# Altium schematic sheet MCU.SchDoc
size A3; SheetNumber: 1; SheetTotal: 5
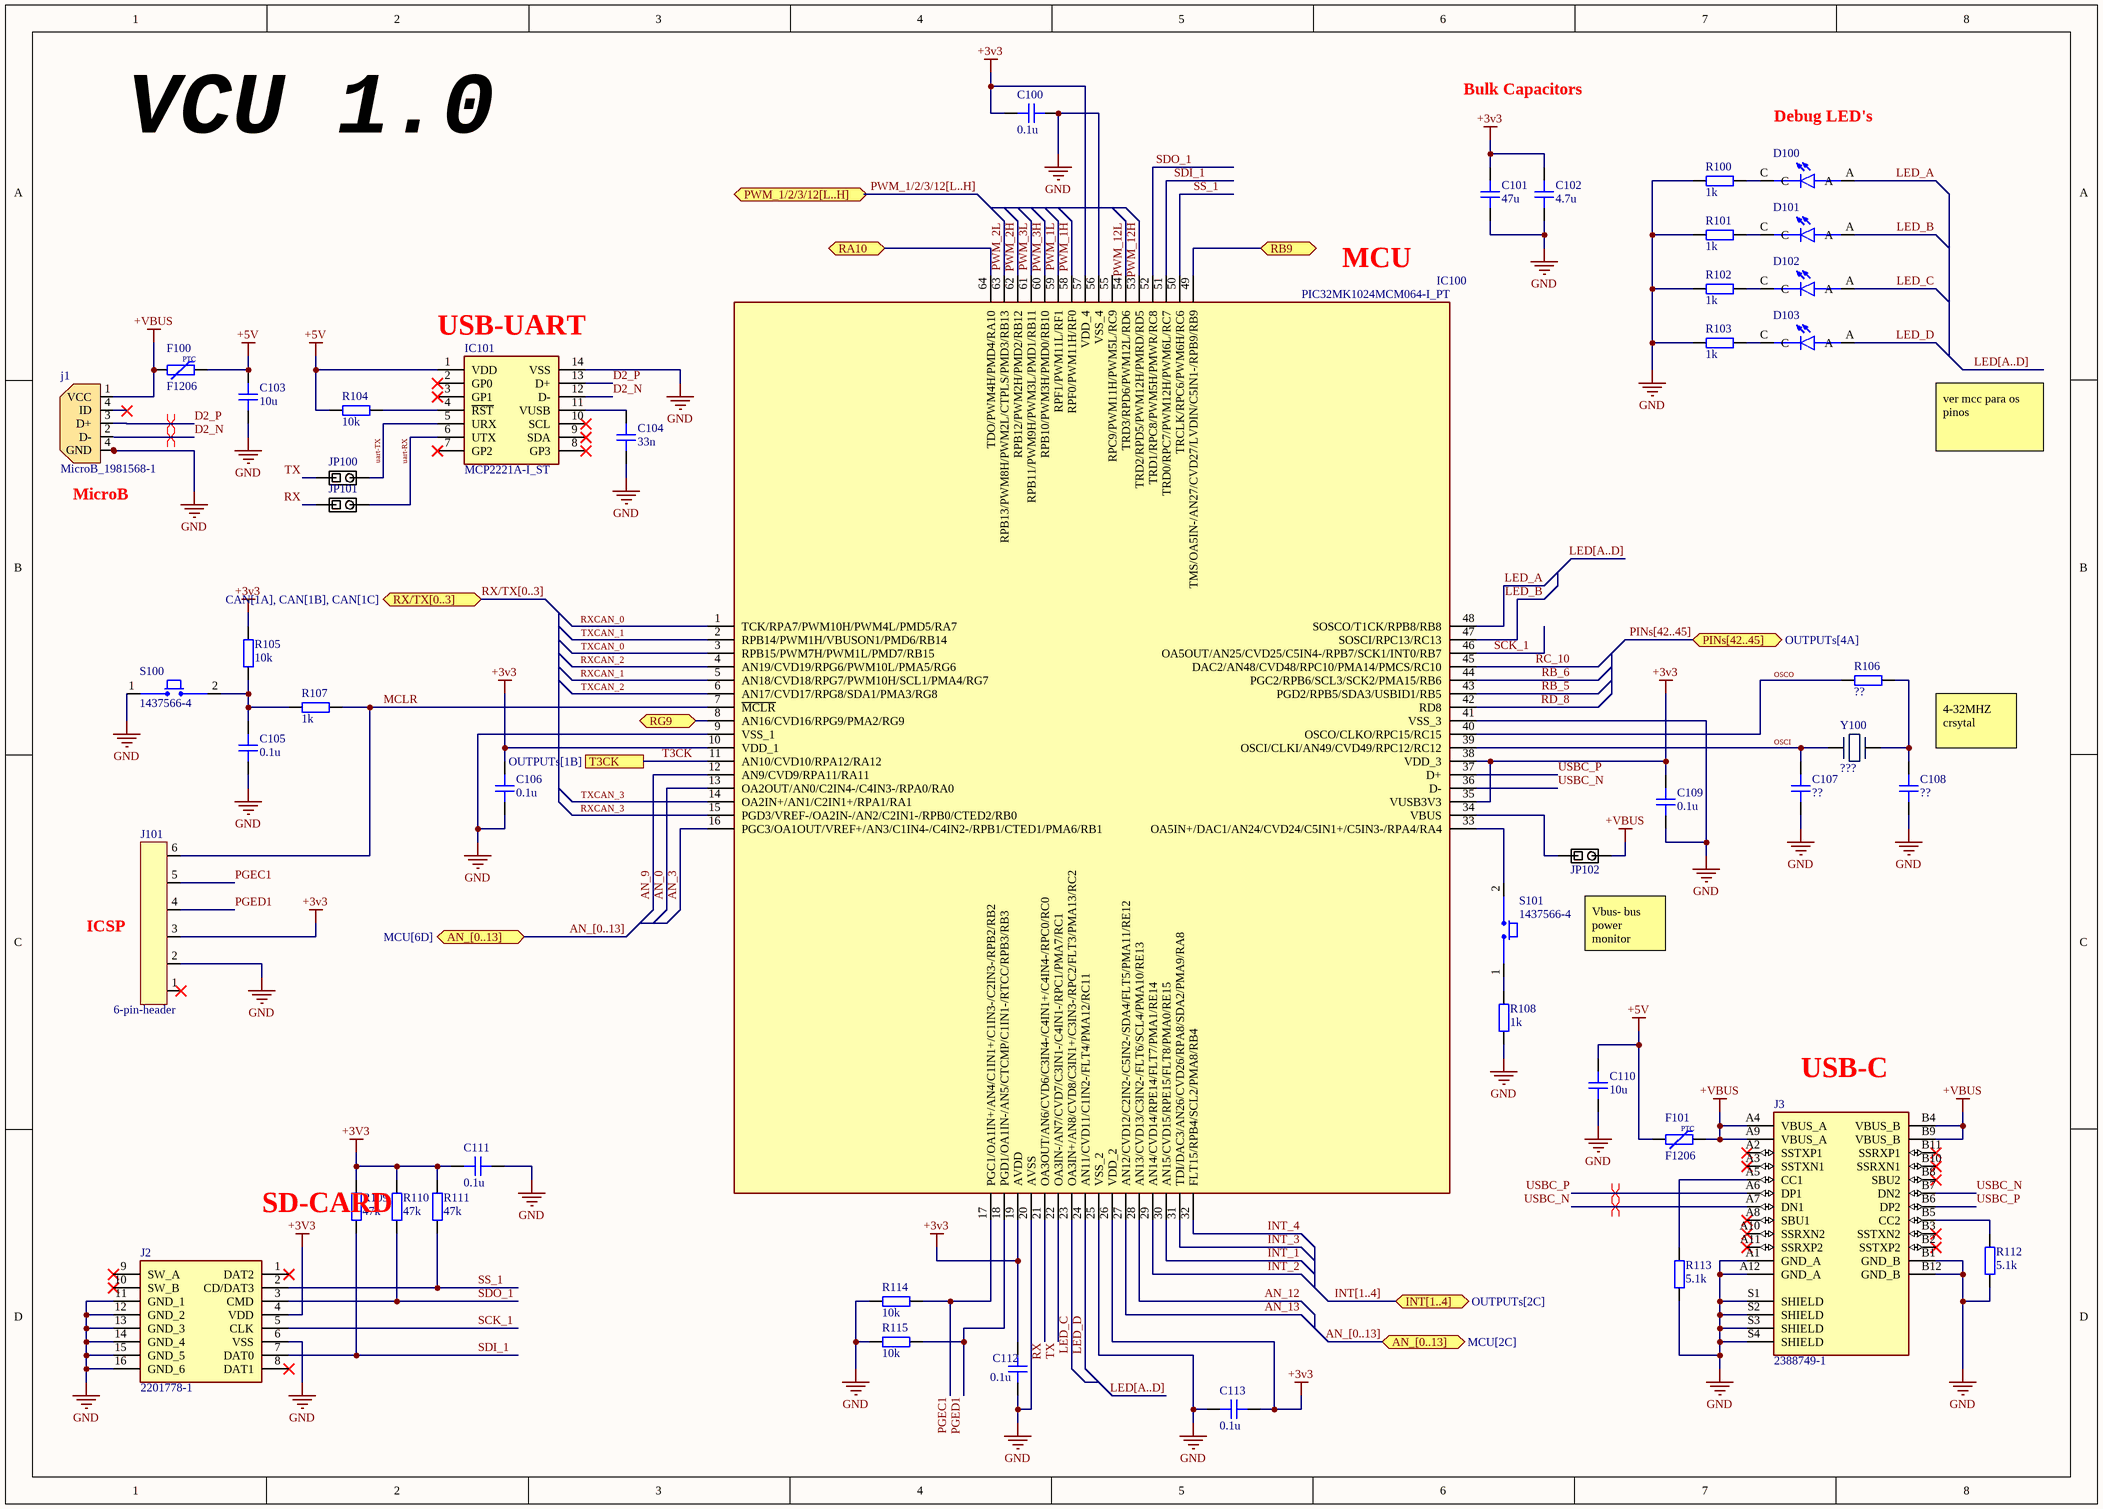
[diagram p0: MCU.SchDoc]

## Parts
C100  0.1u  [CAP_0805]
C101  47u  [CAP_0805]
C102  4.7u  [CAP_0805]
C103  10u  [CAP_0805]
C104  33n  [CAP_0805]
C105  0.1u  [CAP_0805]
C106  0.1u  [CAP_0805]
C107  ??  [CAP_0805]
C108  ??  [CAP_0805]
C109  0.1u  [CAP_0805]
C110  10u  [CAP_0805]
C111  0.1u  [CAP_0805]
C112  0.1u  [CAP_0805]
C113  0.1u  [CAP_0805]
D100  SML-LXT0805IW-TR  [LEDC2012X120N]  (value not drawn)
D101  SML-LXT0805IW-TR  [LEDC2012X120N]  (value not drawn)
D102  SML-LXT0805IW-TR  [LEDC2012X120N]  (value not drawn)
D103  SML-LXT0805IW-TR  [LEDC2012X120N]  (value not drawn)
F100  F1206  [FUSE_1206]
F101  F1206  [FUSE_1206]
IC100  PIC32MK1024MCM064-I_PT  [QFP50P1200X1200X120-64N]
IC101  MCP2221A-I_ST  [SOP65P640X120-14N]
j1  MicroB_1981568-1  [1981568-1]
J2  2201778-1  [22017781]
J3  2388749-1  [TE_2388749-1]
J101  6-pin-header  [G800W302018EU]
JP100  Solder Jumper  [SolderJumper_Single]  (value not drawn)
JP101  Solder Jumper  [SolderJumper_Single]  (value not drawn)
JP102  Solder Jumper  [SolderJumper_Single]  (value not drawn)
R100  1k  [RES_0805]
R101  1k  [RES_0805]
R102  1k  [RES_0805]
R103  1k  [RES_0805]
R104  10k  [RES_0805]
R105  10k  [RES_0805]
R106  ??  [RES_0805]
R107  1k  [RES_0805]
R108  1k  [RES_0805]
R109  47k  [RES_0805]
R110  47k  [RES_0805]
R111  47k  [RES_0805]
R112  5.1k  [RES_0805]
R113  5.1k  [RES_0805]
R114  10k  [RES_0805]
R115  10k  [RES_0805]
S100  1437566-4  [SW_1437566-4]
S101  1437566-4  [SW_1437566-4]
Y100  ???  [ABM38000MHZC4T]

## Ports
AN_[0..13] (bidir, see MCU[2C]), AN_[0..13] (bidir, see MCU[6D]), INT[1..4] (bidir, see OUTPUTs[2C]), PINs[42..45] (bidir, see OUTPUTs[4A]), PWM_1/2/3/12[L..H] (bidir), RA10 (bidir, see OUTPUTs[1C]), RB9 (bidir, see OUTPUTs[1C]), RG9 (bidir, see OUTPUTs[1C]), RX/TX[0..3] (bidir, see CAN[1A], CAN[1B], CAN[1C]), T3CK (see OUTPUTs[1B])

## Nets
+3v3: C100.1 C101.1 C102.1 C106.2 C109.1 C111.2 C112.2 C113.1 IC100.10(VDD_1) IC100.19(AVDD) IC100.26(VDD_2) IC100.35(VUSB3V3) IC100.38(VDD_3) IC100.57(VDD_4) J2.4(VDD) J101.3 R105.2 R109.2 R110.2 R111.2
+5V: C103.1 C110.1 F100.2 F101.1 IC101.1(VDD) R104.2
+VBUS: F100.1 F101.2 j1.1(VCC) J3.A4(VBUS_A) J3.A9(VBUS_A) J3.B4(VBUS_B) J3.B9(VBUS_B) JP102.2
GND: C100.2 C101.2 C102.2 C103.2 C104.1 C105.1 C106.1 C107.1 C108.1 C109.2 C110.2 C111.1 C112.1 C113.2 IC100.9(VSS_1) IC100.20(AVSS) IC100.25(VSS_2) IC100.41(VSS_3) IC100.56(VSS_4) IC101.14(VSS) j1.4(GND) J2.6(VSS) J2.11(GND_1) J2.12(GND_2) J2.13(GND_3) J2.14(GND_4) J2.15(GND_5) J2.16(GND_6) J3.A1(GND_A) J3.A12(GND_A) J3.B1(GND_B) J3.B12(GND_B) J3.S1(SHIELD) J3.S2(SHIELD) J3.S3(SHIELD) J3.S4(SHIELD) J101.2 R100.1 R101.1 R102.1 R103.1 R108.1 R112.2 R113.2 R114.2 R115.1 S100.1
AN_0: IC100.13(OA2OUT/AN0/C2IN4-/C4IN3-/RPA0/RA0)
AN_3: IC100.16(PGC3/OA1OUT/VREF+/AN3/C1IN4-/C4IN2-/RPB1/CTED1/PMA6/RB1)
AN_9: IC100.12(AN9/CVD9/RPA11/RA11)
AN_12: IC100.28(AN13/CVD13/C3IN2-/FLT6/SCL4/PMA10/RE13)
AN_13: IC100.27(AN12/CVD12/C2IN2-/C5IN2-/SDA4/FLT5/PMA11/RE12)
D2_N: IC101.12(D-) j1.2(D-)
D2_P: IC101.13(D+) j1.3(D+)
INT_1: IC100.30(AN15/CVD15/RPE15/FLT8/PMA0/RE15)
INT_2: IC100.29(AN14/CVD14/RPE14/FLT7/PMA1/RE14)
INT_3: IC100.31(TDI/DAC3/AN26/CVD26/RPA8/SDA2/PMA9/RA8)
INT_4: IC100.32(FLT15/RPB4/SCL2/PMA8/RB4)
LED_A: D100.A IC100.48(SOSCO/T1CK/RPB8/RB8)
LED_B: D101.A IC100.47(SOSCI/RPC13/RC13)
LED_C: D102.A IC100.23(OA3IN+/AN8/CVD8/C3IN1+/C3IN3-/RPC2/FLT3/PMA13/RC2)
LED_D: D103.A IC100.24(AN11/CVD11/C1IN2-/FLT4/PMA12/RC11)
MCLR: IC100.7(~{MCLR}) J101.6 R107.2
OSCI: C107.2 IC100.39(OSCI/CLKI/AN49/CVD49/RPC12/RC12) Y100.1
OSCO: IC100.40(OSCO/CLKO/RPC15/RC15) R106.2
PGEC1: IC100.17(PGC1/OA1IN+/AN4/C1IN1+/C1IN3-/C2IN3-/RPB2/RB2) J101.5 R114.1
PGED1: IC100.18(PGD1/OA1IN-/AN5/CTCMP/C1IN1-/RTCC/RPB3/RB3) J101.4 R115.2
PWM_1H: IC100.58(RPF0/PWM11H/RF0)
PWM_1L: IC100.59(RPF1/PWM11L/RF1)
PWM_2H: IC100.62(RPB12/PWM2H/PMD2/RB12)
PWM_2L: IC100.63(RPB13/PWM8H/PWM2L/CTPLS/PMD3/RB13)
PWM_3H: IC100.60(RPB10/PWM3H/PMD0/RB10)
PWM_3L: IC100.61(RPB11/PWM9H/PWM3L/PMD1/RB11)
PWM_12H: IC100.53(TRD2/RPD5/PWM12H/PMRD/RD5)
PWM_12L: IC100.54(TRD3/RPD6/PWM12L/RD6)
RA10: IC100.64(TDO/PWM4H/PMD4/RA10) ; port RA10
RB9: IC100.49(TMS/OA5IN-/AN27/CVD27/LVDIN/C5IN1-/RPB9/RB9) ; port RB9
RB_5: IC100.43(PGD2/RPB5/SDA3/USBID1/RB5)
RB_6: IC100.44(PGC2/RPB6/SCL3/SCK2/PMA15/RB6)
RC_10: IC100.45(DAC2/AN48/CVD48/RPC10/PMA14/PMCS/RC10)
RD_8: IC100.42(RD8)
RG9: IC100.8(AN16/CVD16/RPG9/PMA2/RG9) ; port RG9
RX: IC100.21(OA3OUT/AN6/CVD6/C3IN4-/C4IN1+/C4IN4-/RPC0/RC0) JP101.1
RXCAN_0: IC100.1(TCK/RPA7/PWM10H/PWM4L/PMD5/RA7)
RXCAN_1: IC100.5(AN18/CVD18/RPG7/PWM10H/SCL1/PMA4/RG7)
RXCAN_2: IC100.4(AN19/CVD19/RPG6/PWM10L/PMA5/RG6)
RXCAN_3: IC100.15(PGD3/VREF-/OA2IN-/AN2/C2IN1-/RPB0/CTED2/RB0)
SCK_1: IC100.46(OA5OUT/AN25/CVD25/C5IN4-/RPB7/SCK1/INT0/RB7) J2.5(CLK)
SDI_1: IC100.51(TRD0/RPC7/PWM12H/PWM6L/RC7) J2.7(DAT0) R109.1
SDO_1: IC100.52(TRD1/RPC8/PWM5H/PMWR/RC8) J2.3(CMD) R110.1
SS_1: IC100.50(TRCLK/RPC6/PWM6H/RC6) J2.2(CD/DAT3) R111.1
T3CK: IC100.11(AN10/CVD10/RPA12/RA12) ; port T3CK
TX: IC100.22(OA3IN-/AN7/CVD7/C3IN1-/C4IN1-/RPC1/PMA7/RC1) JP100.1
TXCAN_0: IC100.3(RPB15/PWM7H/PWM1L/PMD7/RB15)
TXCAN_1: IC100.2(RPB14/PWM1H/VBUSON1/PMD6/RB14)
TXCAN_2: IC100.6(AN17/CVD17/RPG8/SDA1/PMA3/RG8)
TXCAN_3: IC100.14(OA2IN+/AN1/C2IN1+/RPA1/RA1)
uart-RX: IC101.6(UTX) JP101.2
uart-TX: IC101.5(URX) JP100.2
USBC_N: IC100.36(D-) J3.A7(DN1) J3.B7(DN2)
USBC_P: IC100.37(D+) J3.A6(DP1) J3.B6(DP2)
NetC104_2: C104.2 IC101.11(VUSB)
NetC105_2: C105.2 R105.1 R107.1 S100.2
NetC108_2: C108.2 R106.1 Y100.2
NetD100_C: D100.C R100.2
NetD101_C: D101.C R101.2
NetD102_C: D102.C R102.2
NetD103_C: D103.C R103.2
NetIC100_33: IC100.33(OA5IN+/DAC1/AN24/CVD24/C5IN1+/C5IN3-/RPA4/RA4) S101.2
NetIC100_34: IC100.34(VBUS) JP102.1
NetIC101_4: IC101.4(~{RST}) R104.1
NetJ3_A5: J3.A5(CC1) R113.1
NetJ3_B5: J3.B5(CC2) R112.1
NetR108_2: R108.2 S101.1

Not connected (* = marked no-connect by the designer): IC100 55(RPC9/PWM11H/PWM5L/RC9); IC101 2(GP0)* 3(GP1)* 7(GP2)* 8(GP3)* 9(SDA)* 10(SCL)*; J2 1(DAT2)* 8(DAT1)* 9(SW_A)* 10(SW_B)*; J3 A2(SSTXP1)* A3(SSTXN1)* A8(SBU1)* A10(SSRXN2)* A11(SSRXP2)* B2(SSTXP2)* B3(SSTXN2)* B8(SBU2)* B10(SSRXN1)* B11(SSRXP1)*; J101 1*

## Buses and harness runs
bus AN_[0..13] = port AN_[0..13]
bus INT[1..4] = port INT[1..4]
bus LED[A..D]
bus PINs[42..45] = port PINs[42..45]
bus PWM_1/2/3/12[L..H] = port PWM_1/2/3/12[L..H]
bus RX/TX[0..3] = port RX/TX[0..3]

## Layout directives
differential pair; net class DIFF_USB: D2_N, D2_P
differential pair: USBC_N, USBC_P

## Notes on the sheet
- Bulk Capacitors
- VCU 1.0
- Debug LED's
- (near IC100) MCU
- (near IC101) USB-UART
- ver mcc para os pinos
- (near j1) MicroB
- 4-32MHZ crsytal
- (near J101) ICSP
- (near JP102) Vbus- bus power monitor
- (near J3) USB-C
- SD-CARD
- (in symbol FUSE_PPTC_1206) PTC

## Library data of the parts
C100-C102 C105-C109 C112 C113 = CAP_0805_16V: Capacitor SMD 0805 16V
C103 C104 C110 C111 = CAP_0805_10V: Capacitor SMD 0805 10V
D100-D103 = SML-LXT0805IW-TR: Red - LED Indication - Discrete 2V 0805 (2012 Metric); MF: Lumex Opto/Components; Check_prices: https://www.snapeda.com/parts/SML-LXT0805IW-TR/Lumex+Opto%252FComponents+Inc./view-part/?ref=eda; Price: None; MP: SML-LXT0805IW-TR; SnapEDA_Link: https://www.snapeda.com/parts/SML-LXT0805IW-TR/Lumex+Opto%252FComponents+Inc./view-part/?ref=snap; Availability: In Stock; Value: *; Purchase-URL: https://pricing.snapeda.com/search/part/SML-LXT0805IW-TR/?ref=eda; Package: 0805 Lumex
F100 F101 = FUSE_PPTC_1206: Fuse PPTC SMD 1206; Manufacturer: *; Manufacturer Part Number: *
IC100 = PIC32MK1024MCM064-I_PT: Integrated Circuit; Manufacturer_Name: Microchip; Manufacturer_Part_Number: PIC32MK1024MCM064-I/PT; Datasheet Link: https://ww1.microchip.com/downloads/aemDocuments/documents/MCU32/ProductDocuments/DataSheets/PIC32MK-GPK-MCM-with-CAN-FD-Family-DataSheet-DS60001519E.pdf; Height: 1.2mm; Mouser Part Number: 579-2MK1024MCM064IPT; Mouser Price/Stock: https://www.mouser.co.uk/ProductDetail/Microchip-Technology/PIC32MK1024MCM064-I-PT?qs=W%2FMpXkg%252BdQ4dBI32NJdQMg%3D%3D; Arrow Part Number: PIC32MK1024MCM064-I/PT; Arrow Price/Stock: https://www.arrow.com/en/products/pic32mk1024mcm064-ipt/microchip-technology?region=nac
IC101 = MCP2221A-I_ST: Integrated Circuit; Manufacturer_Name: Microchip; Manufacturer_Part_Number: MCP2221A-I/ST; Datasheet Link: http://ww1.microchip.com/downloads/en/devicedoc/20005565b.pdf; Height: 1.2mm; Mouser Part Number: 579-MCP2221A-I/ST; Mouser Price/Stock: https://www.mouser.co.uk/ProductDetail/Microchip-Technology-Atmel/MCP2221A-I-ST?qs=ZEMkBHnybREMkqMgzOrcGQ%3D%3D; Arrow Part Number: MCP2221A-I/ST; Arrow Price/Stock: https://www.arrow.com/en/products/mcp2221a-ist/microchip-technology?region=nac
j1 = Micro_B
J2 = 2201778-1: Connector; Manufacturer_Name: TE Connectivity; Datasheet Link: https://www.te.com/commerce/DocumentDelivery/DDEController?Action=showdoc&DocId=Customer+Drawing%7F2201778%7FB%7Fpdf%7FJapanese%7FJPN_CD_2201778_B.pdf%7F2201778-1; Height: 1.95mm; Manufacturer_Part_Number: 2201778-1; Mouser Part Number: 571-2201778-1; Mouser Price/Stock: https://www.mouser.co.uk/ProductDetail/TE-Connectivity/2201778-1?qs=%2F6W%2F9%2FHWvcBMWWw9w8oBng%3D%3D; Arrow Part Number: 2201778-1; Arrow Price/Stock: https://www.arrow.com/en/products/2201778-1/te-connectivity?region=nac
J3 = 2388749-1: USB-C (USB TYPE-C) USB 4.0 Receptacle Connector 24 Position Surface Mount, Right Angle; Through Hole; MF: TE Connectivity; Value: *; SnapEDA_Link: https://www.snapeda.com/parts/2388749-1/TE+Connectivity/view-part/?ref=snap; Purchase-URL: https://pricing.snapeda.com/search/part/2388749-1/?ref=eda; Availability: In Stock; Price: None; Package: None; Check_prices: https://www.snapeda.com/parts/2388749-1/TE+Connectivity/view-part/?ref=eda; MP: 2388749-1
J101 = G800W302018EU: Pin Header 6 Position 2.54mm Pitch; Manufacturer: Amphenol; Manufacturer Part Number: G800W302018EU
JP100-JP102 = SolderJumper_Single: Solder Jumper Single 0.5mm Pitch
R100-R115 = RES_0805: Resistor SMD 0805
S100 S101 = 1437566-4: Tactile Switch SPST-NO Top Actuated Surface Mount; MF: TE Connectivity; Check_prices: https://www.snapeda.com/parts/1437566-4/TE+Connectivity+ALCOSWITCH+Switches/view-part/?ref=eda; Package: None; MP: 1437566-4; Value: *; SnapEDA_Link: https://www.snapeda.com/parts/1437566-4/TE+Connectivity+ALCOSWITCH+Switches/view-part/?ref=snap
Y100 = Crystal_SMD